# Altium project interface.PrjPcb
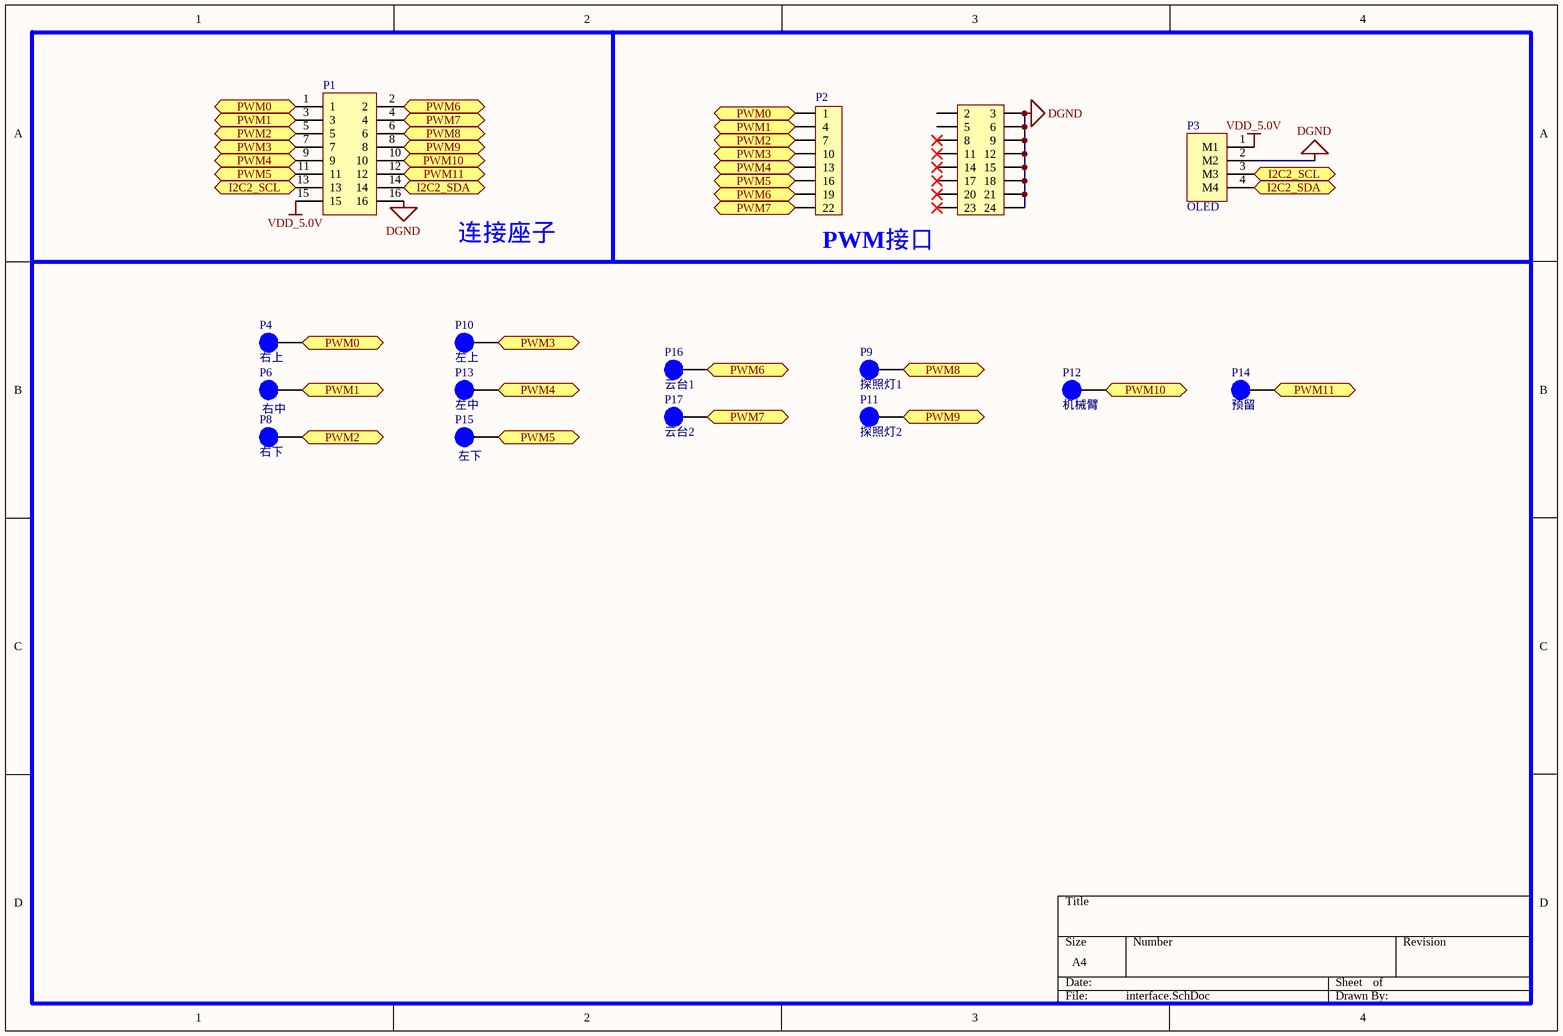
[diagram p0: interface.SchDoc]
1 sheet, 15 parts. Net scope: flat (ports and power ports of the same name join across sheets).
Board file: interface.PcbDoc

## Sheet interface.SchDoc
size A4

### Parts
P1  (no value)  [HEADER 2X8 反向]
P2  (no value)  [Header 8X3]
P3  OLED  [OLED12864]
P4  右上  [PIN 1]
P6  右中  [PIN 1]
P8  右下  [PIN 1]
P9  探照灯1  [PIN 1]
P10  左上  [PIN 1]
P11  探照灯2  [PIN 1]
P12  机械臂  [PIN 1]
P13  左中  [PIN 1]
P14  预留  [PIN 1]
P15  左下  [PIN 1]
P16  云台1  [PIN 1]
P17  云台2  [PIN 1]

### Ports
I2C2_SCL, I2C2_SDA, PWM0, PWM1, PWM2, PWM3, PWM4, PWM5, PWM6, PWM7, PWM8, PWM9, PWM10, PWM11

### Nets
DGND: P1.16 P2.3 P2.6 P2.9 P2.12 P2.15 P2.18 P2.21 P2.24 P3.2(M2)
VDD_5.0V: P1.15 P3.1(M1)
I2C2_SCL: P1.13 P3.3(M3) ; port I2C2_SCL
I2C2_SDA: P1.14 P3.4(M4) ; port I2C2_SDA
PWM0: P1.1 P2.1 P4.1 ; port PWM0
PWM1: P1.3 P2.4 P6.1 ; port PWM1
PWM2: P1.5 P2.7 P8.1 ; port PWM2
PWM3: P1.7 P2.10 P10.1 ; port PWM3
PWM4: P1.9 P2.13 P13.1 ; port PWM4
PWM5: P1.11 P2.16 P15.1 ; port PWM5
PWM6: P1.2 P2.19 P16.1 ; port PWM6
PWM7: P1.4 P2.22 P17.1 ; port PWM7
PWM8: P1.6 P9.1 ; port PWM8
PWM9: P1.8 P11.1 ; port PWM9
PWM10: P1.10 P12.1 ; port PWM10
PWM11: P1.12 P14.1 ; port PWM11

Not connected (* = marked no-connect by the designer): P2 2 5 8* 11* 14* 17* 20* 23*

### Notes on the sheet
- 连接座子
- (near P2) PWM接口

### Library data of the parts
P1 = Header 2X8
P2 = Header 8X3
P3 = 接线端子-4PIN: 4PIN
P4 P6 P8-P17 = 测试点